# Altium schematic sheet CJMCU-FT232HQ-PROGRAMMER.SchDoc: CJMCU-FT232HQ Programmer
size A4; Author: Meysam Parvizi; DrawnBy: Meysam Parvizi; SheetNumber: 1; SheetTotal: 1
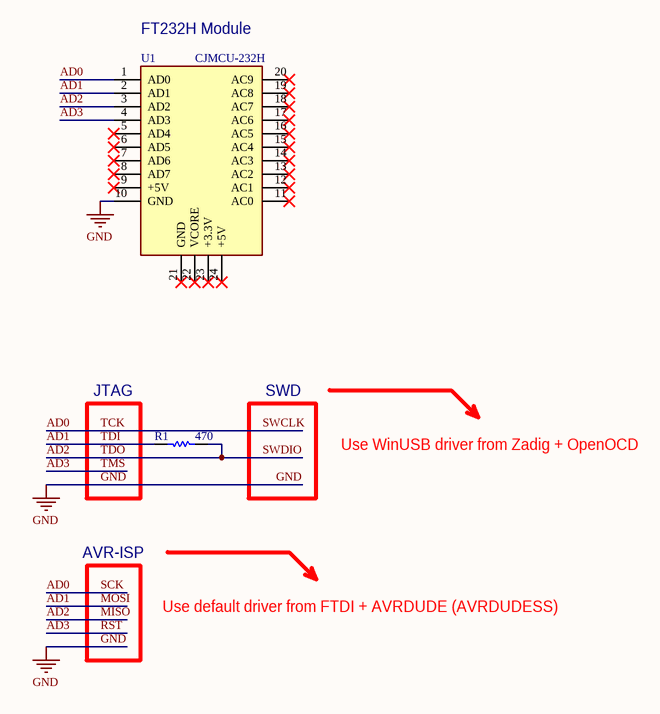
[diagram p0: CJMCU-FT232HQ-PROGRAMMER.SchDoc]

## Parts
R1  value 470  [R0805]  (hidden comment: CRG0805F10K)
U1  CJMCU-232H  [CJMCU-232H]

## Nets
GND: U1.10(GND)
AD0: U1.1(AD0)  [also labelled SCK, SWCLK, TCK]
AD1: R1.2 U1.2(AD1)  [also labelled MOSI, TDI]
AD2: R1.1 U1.3(AD2)  [also labelled MISO, SWDIO, TDO]
AD3: U1.4(AD3)  [also labelled RST, TMS]

Not connected (* = marked no-connect by the designer): U1 5(AD4)* 6(AD5)* 7(AD6)* 8(AD7)* 9(+5V)* 11(AC0)* 12(AC1)* 13(AC2)* 14(AC3)* 15(AC4)* 16(AC5)* 17(AC6)* 18(AC7)* 19(AC8)* 20(AC9)* 21(GND)* 22(VCORE)* 23(+3.3V)* 24(+5V)*

## Notes on the sheet
- (near U1) FT232H Module
- JTAG
- SWD
- Use WinUSB driver from Zadig + OpenOCD
- AVR-ISP
- Use default driver from FTDI + AVRDUDE (AVRDUDESS)
- Title:
- Designed By:
- Meysam Parvizi
- GitHub:
- https://github.com/m3y54m
- File:
- Project Git Hash:
- Project:
- Date:
- Sheet
- Revision:
- of
- Size:
- A4
- File Git Hash:

## Library data of the parts
R1 = RESISTOR: RES SMD 10K OHM 1% 1/8W 0805; Temperature Coefficient: 100ppm/°C; Power Rating: 125mW; Voltage Rating: 150V; Number of Resistors: 1; RoHS Compliant: Yes; Tolerance: 1%; Mount: Surface Mount; Radiation Hardening: No; Depth: 1.25mm; Termination: Solder; Series: CRG Series; Packaging: Tape and Reel; Number of Terminations: 2; Resistor Type: Thick Film; Length: 2mm; Height: 0.55mm; ELV: Compliant; Case/Package: 0805; Min Operating Temperature: -55°C; Max Operating Temperature: 125°C; Technology: THICK FILM
U1 = CJMCU-232H: CNMCU FT232HQ Breakout Board